# Altium schematic sheet G3-Sensor.SchDoc
size A2; SheetNumber: 3; SheetTotal: 3
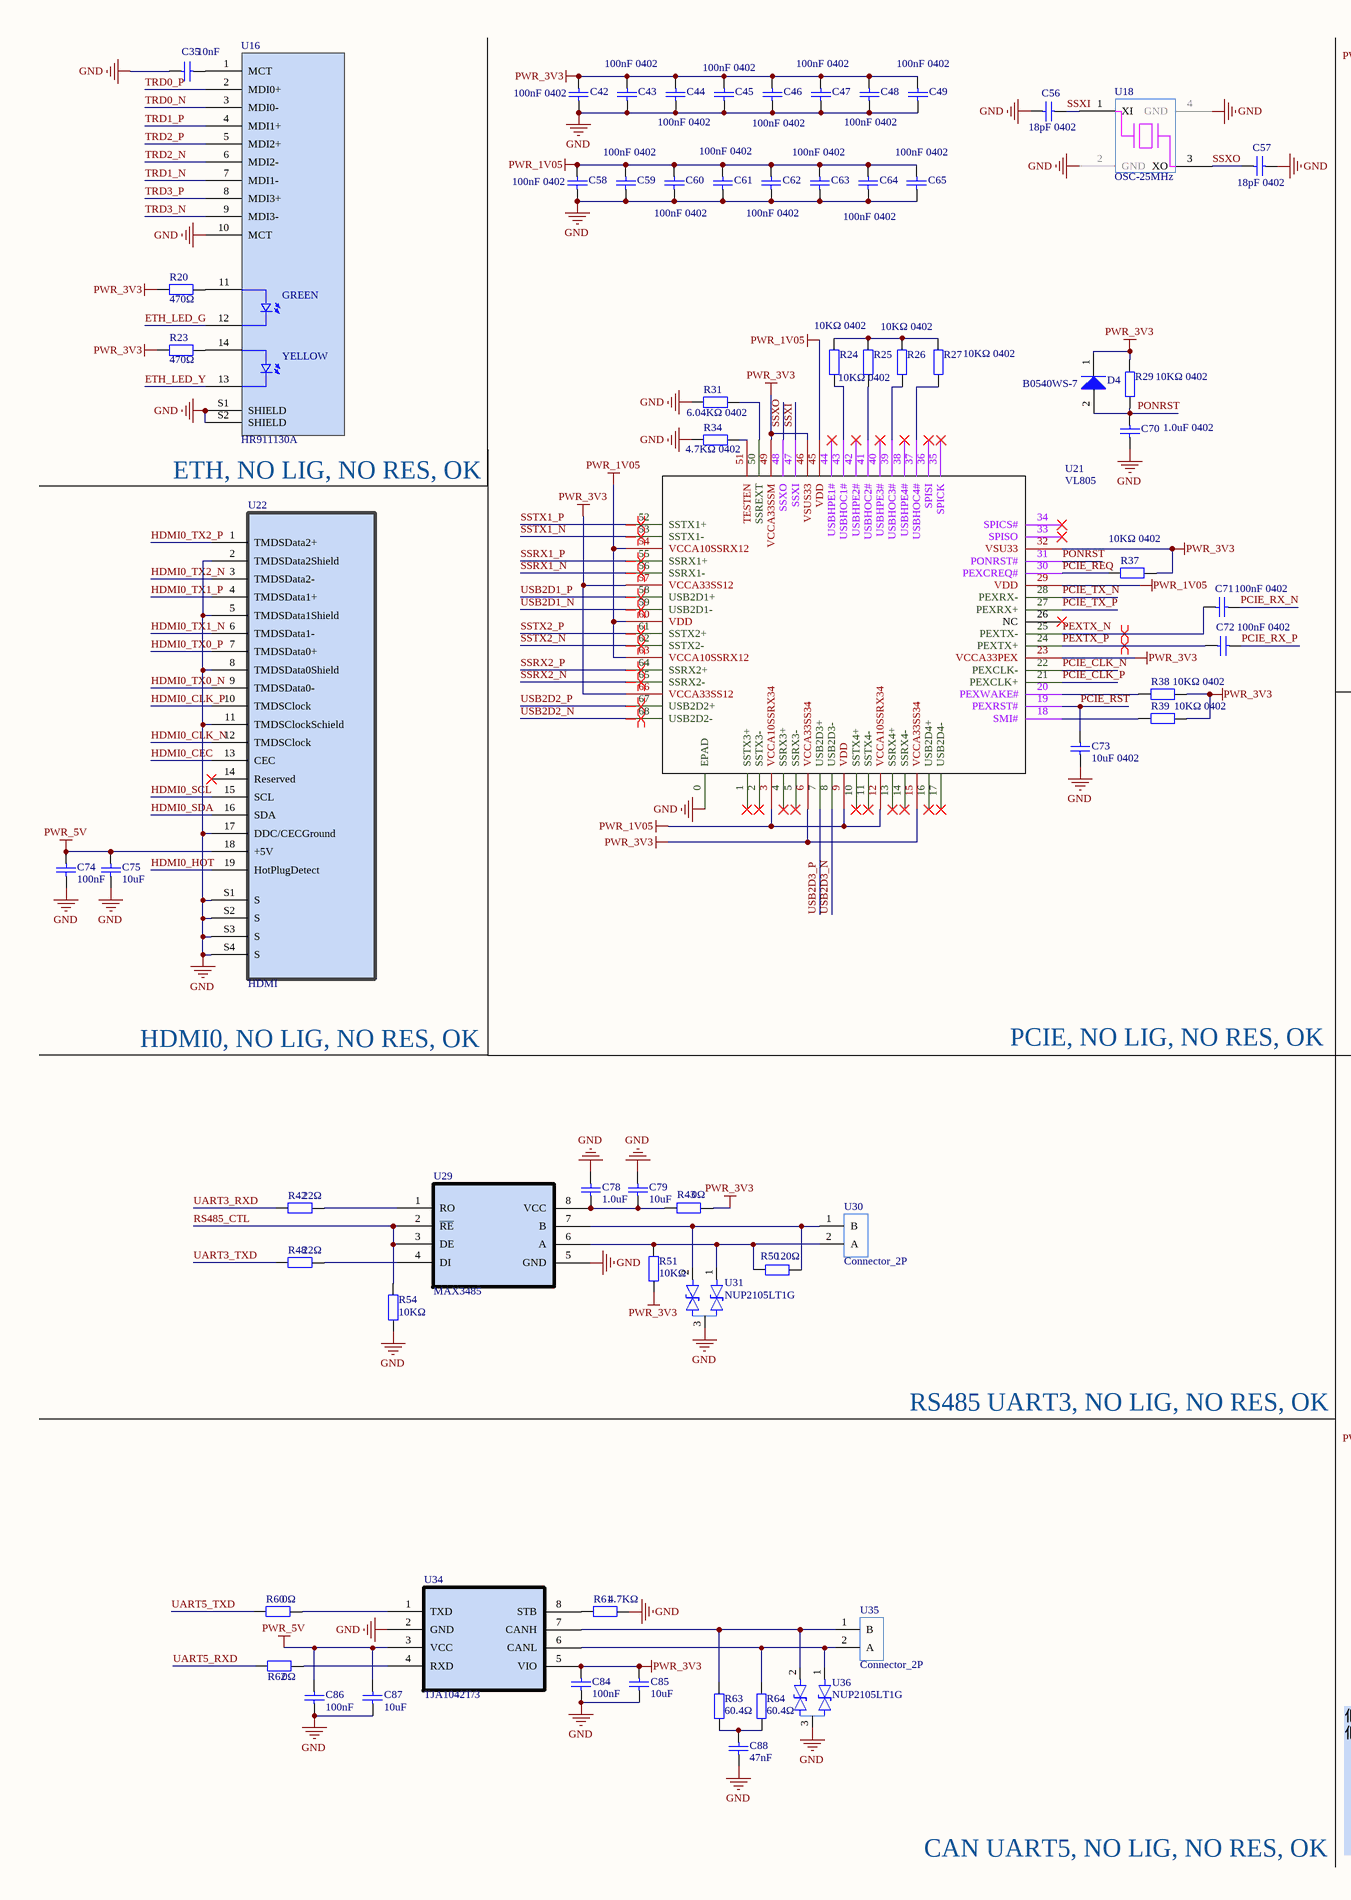
[diagram p0: G3-Sensor.SchDoc, left]
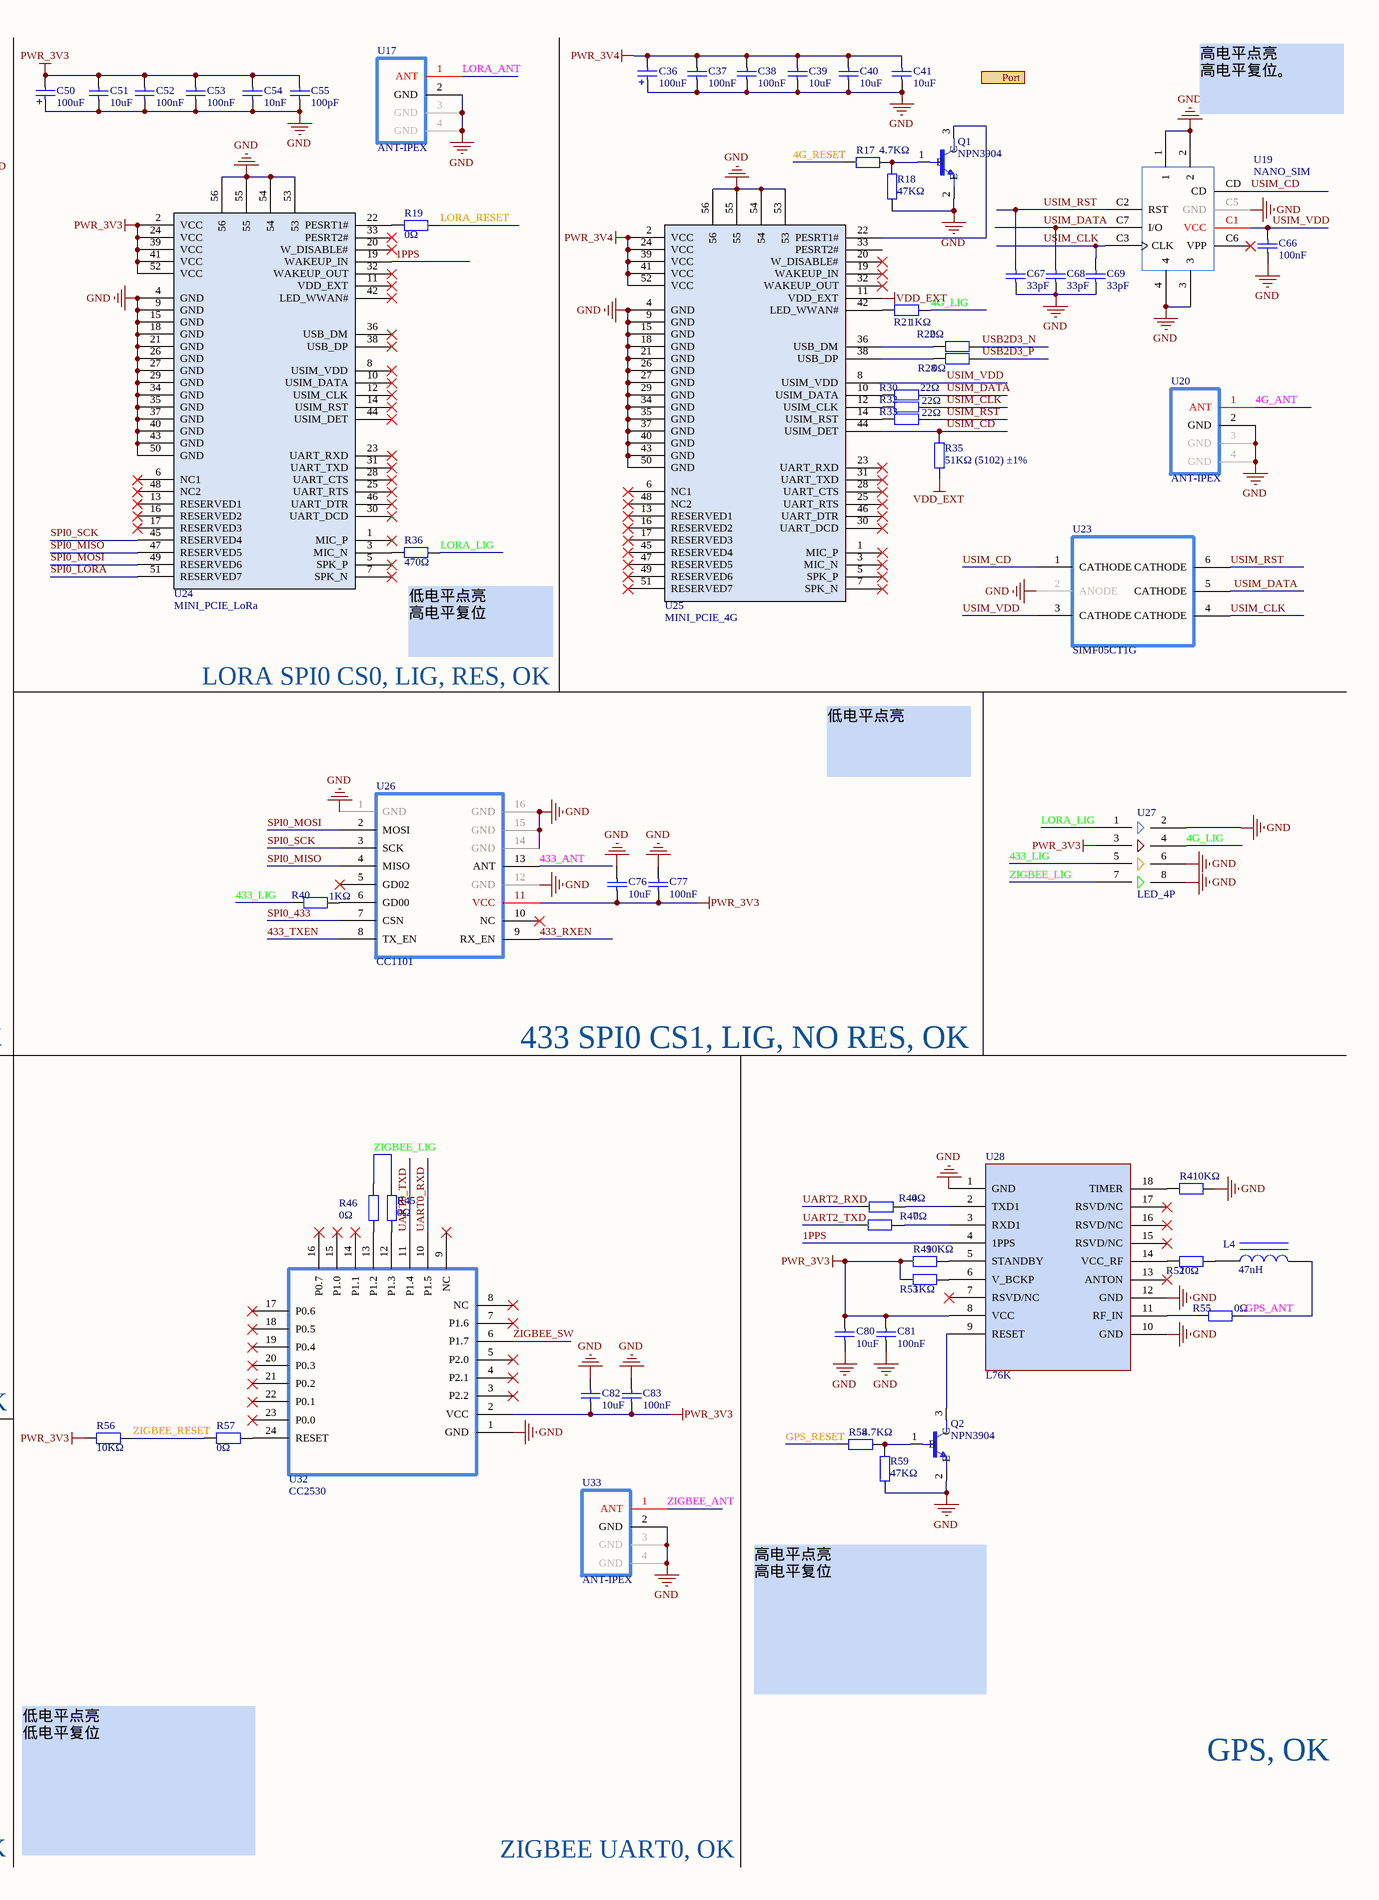
[diagram p1: G3-Sensor.SchDoc, right]

## Parts
C35  10nF  [0402_C]
C36  100uF  [CASE-B_3528]
C37  100nF  [1206_C]
C38  100nF  [1206_C]
C39  10uF  [1206_C]
C40  10uF  [1206_C]
C41  10uF  [1206_C]
C42  100nF 0402  [0402_C]
C43  100nF 0402  [0402_C]
C44  100nF 0402  [0402_C]
C45  100nF 0402  [0402_C]
C46  100nF 0402  [0402_C]
C47  100nF 0402  [0402_C]
C48  100nF 0402  [0402_C]
C49  100nF 0402  [0402_C]
C50  100uF  [CASE-B_3528]
C51  10uF  [0402_C]
C52  100nF  [0402_C]
C53  100nF  [0402_C]
C54  10nF  [0402_C]
C55  100pF  [0402_C]
C56  18pF 0402  [0402_C]
C57  18pF 0402  [0402_C]
C58  100nF 0402  [0402_C]
C59  100nF 0402  [0402_C]
C60  100nF 0402  [0402_C]
C61  100nF 0402  [0402_C]
C62  100nF 0402  [0402_C]
C63  100nF 0402  [0402_C]
C64  100nF 0402  [0402_C]
C65  100nF 0402  [0402_C]
C66  100nF  [0402_C]
C67  33pF  [0402_C]
C68  33pF  [0402_C]
C69  33pF  [0402_C]
C70  1.0uF 0402  [0402_C]
C71  100nF 0402  [0402_C]
C72  100nF 0402  [0402_C]
C73  10uF 0402  [0402_C]
C74  100nF  [0402_C]
C75  10uF  [0402_C]
C76  10uF  [0402_C]
C77  100nF  [0402_C]
C78  1.0uF  [0402_C]
C79  10uF  [0402_C]
C80  10uF  [0402_C]
C81  100nF  [0402_C]
C82  10uF  [0402_C]
C83  100nF  [0402_C]
C84  100nF  [0402_C]
C85  10uF  [0402_C]
C86  100nF  [0402_C]
C87  10uF  [0402_C]
C88  47nF  [0402_C]
D4  B0540WS-7  [B0540WS-7]
L4  47nH  [0603_L]
Q1  NPN3904  [NPN3904]
Q2  NPN3904  [NPN3904]
R17  4.7KΩ  [0402_R]
R18  47KΩ  [0402_R]
R19  0Ω  [0402_R]
R20  470Ω  [0402_R]
R21  1KΩ  [0402_R]
R22  0Ω  [0402_R]
R23  470Ω  [0402_R]
R24  10KΩ 0402  [0402_R]
R25  10KΩ 0402  [0402_R]
R26  10KΩ 0402  [0402_R]
R27  10KΩ 0402  [0402_R]
R28  0Ω  [0402_R]
R29  10KΩ 0402  [0402_R]
R30  22Ω  [0402_R]
R31  6.04KΩ 0402  [0402_R]
R32  22Ω  [0402_R]
R33  22Ω  [0402_R]
R34  4.7KΩ 0402  [0402_R]
R35  51KΩ (5102) ±1%  [0402_R]
R36  470Ω  [0402_R]
R37  10KΩ 0402  [0402_R]
R38  10KΩ 0402  [0402_R]
R39  10KΩ 0402  [0402_R]
R40  1KΩ  [0402_R]
R41  10KΩ  [0402_R]
R42  22Ω  [0402_R]
R43  0Ω  [0402_R]
R44  0Ω  [0402_R]
R45  0Ω  [0402_R]
R46  0Ω  [0402_R]
R47  0Ω  [0402_R]
R48  22Ω  [0402_R]
R49  10KΩ  [0402_R]
R50  120Ω  [0402_R]
R51  10KΩ  [0402_R]
R52  10Ω  [0402_R]
R53  1KΩ  [0402_R]
R54  10KΩ  [0402_R]
R55  0Ω  [0402_R]
R56  10KΩ  [0402_R]
R57  0Ω  [0402_R]
R58  4.7KΩ  [0402_R]
R59  47KΩ  [0402_R]
R60  0Ω  [0402_R]
R61  4.7KΩ  [0402_R]
R62  0Ω  [0402_R]
R63  60.4Ω  [0402_R]
R64  60.4Ω  [0402_R]
U16  HR911130A  [HR911130A]
U17  ANT-IPEX  [ANT-IPEX]
U18  OSC-25MHz  [OSC-25MHz]
U19  NANO_SIM  [NANO_SIM]
U20  ANT-IPEX  [ANT-IPEX]
U21  VL805  [VL805]
U22  HDMI  [HDMI]
U23  SIMF05CT1G  [SMF05CT1G]
U24  MINI_PCIE_LoRa  [MINI-PCIE]
U25  MINI_PCIE_4G  [MINI-PCIE]
U26  CC1101  [CC1101]
U27  LED_4P  [LED_4P]
U28  L76K  [L76K]
U29  MAX3485  [MAX3485]
U30  Connector_2P  [CONNECTOR_2P]
U31  NUP2105LT1G  [NUP2105LT1G]
U32  CC2530  [CC2530]
U33  ANT-IPEX  [ANT-IPEX]
U34  TJA1042T/3  [TJA1042T]
U35  Connector_2P  [CONNECTOR_2P]
U36  NUP2105LT1G  [NUP2105LT1G]

## Ports
Port

## Nets
GND: C35.1 C36.1 C37.1 C38.1 C39.1 C40.1 C41.1 C42.1 C43.1 C44.1 C45.1 C46.1 C47.1 C48.1 C49.1 C50.1 C51.1 C52.1 C53.1 C54.1 C55.1 C56.1 C57.2 C58.1 C59.1 C60.1 C61.1 C62.1 C63.1 C64.1 C65.1 C66.1 C67.1 C68.1 C69.1 C70.2 C73.1 C74.1 C75.1 C76.2 C77.2 C78.2 C79.2 C80.1 C81.1 C82.2 C83.2 C84.1 C85.1 C86.1 C87.1 C88.1 Q1.2(E) Q2.2(E) R18.1 R31.2 R34.2 R41.2 R54.1 R59.1 R61.2 U16.10(MCT) U16.S1(SHIELD) U16.S2(SHIELD) U17.2(GND) U17.3(GND) U17.4(GND) U18.2(GND) U18.4(GND) U19.1 U19.2 U19.3 U19.4 U19.C5(GND) U20.2(GND) U20.3(GND) U20.4(GND) U21.0(EPAD) U22.2(TMDSData2Shield) U22.5(TMDSData1Shield) U22.8(TMDSData0Shield) U22.11(TMDSClockSchield) U22.17(DDC/CECGround) U22.S1(S) U22.S2(S) U22.S3(S) U22.S4(S) U23.2(ANODE) U24.4(GND) U24.9(GND) U24.15(GND) U24.18(GND) U24.21(GND) U24.26(GND) U24.27(GND) U24.29(GND) U24.34(GND) U24.35(GND) U24.37(GND) U24.40(GND) U24.43(GND) U24.50(GND) U24.53 U24.54 U24.55 U24.56 U25.4(GND) U25.9(GND) U25.15(GND) U25.18(GND) U25.21(GND) U25.26(GND) U25.27(GND) U25.29(GND) U25.34(GND) U25.35(GND) U25.37(GND) U25.40(GND) U25.43(GND) U25.50(GND) U25.53 U25.54 U25.55 U25.56 U26.1(GND) U26.12(GND) U26.14(GND) U26.15(GND) U26.16(GND) U27.2 U27.6 U27.8 U28.1(GND) U28.10(GND) U28.12(GND) U29.5(GND) U31.3 U32.1(GND) U33.2(GND) U33.3(GND) U33.4(GND) U34.2(GND) U36.3
PWR_1V05: C58.2 C59.2 C60.2 C61.2 C62.2 C63.2 C64.2 C65.2 U21.3(VCCA10SSRX34) U21.9(VDD) U21.12(VCCA10SSRX34) U21.29(VDD) U21.45(VDD) U21.54(VCCA10SSRX12) U21.60(VDD) U21.63(VCCA10SSRX12)
PWR_3V3: C42.2 C43.2 C44.2 C45.2 C46.2 C47.2 C48.2 C49.2 C50.2 C51.2 C52.2 C53.2 C54.2 C55.2 C76.1 C77.1 C80.2 C81.2 C82.1 C83.1 C84.2 C85.2 D4.1(K) R20.1 R23.1 R29.2 R37.2 R38.2 R39.2 R43.2 R49.1 R51.1 R53.1 R56.1 U21.6(VCCA33SS34) U21.15(VCCA33SS34) U21.23(VCCA33PEX) U21.32(VSU33) U21.46(VSUS33) U21.49(VCCA33SSM) U21.57(VCCA33SS12) U21.66(VCCA33SS12) U24.2(VCC) U24.24(VCC) U24.39(VCC) U24.41(VCC) U24.52(VCC) U26.11(VCC) U27.3 U28.8(VCC) U32.2(VCC) U34.5(VIO)
PWR_3V4: C36.2 C37.2 C38.2 C39.2 C40.2 C41.2 U25.2(VCC) U25.24(VCC) U25.39(VCC) U25.41(VCC) U25.52(VCC)
PWR_5V: C74.2 C75.2 C86.2 C87.2 U22.18(+5V) U34.3(VCC)
VDD_EXT: R35.1 U25.11(VDD_EXT)
1PPS: U24.19(WAKEUP_IN) U28.4(1PPS)
4G_ANT: U20.1(ANT)
4G_LIG: R21.2 U27.4
4G_RESET: R17.1
433_ANT: U26.13(ANT)
433_LIG: R40.1 U27.5
433_RXEN: U26.9(RX_EN)
433_TXEN: U26.8(TX_EN)
ETH_LED_G: U16.12
ETH_LED_Y: U16.13
GPS_ANT: L4.2 R55.2
GPS_RESET: R58.1
HDMI0_CEC: U22.13(CEC)
HDMI0_CLK_N: U22.12(TMDSClock)
HDMI0_CLK_P: U22.10(TMDSClock)
HDMI0_HOT: U22.19(HotPlugDetect)
HDMI0_SCL: U22.15(SCL)
HDMI0_SDA: U22.16(SDA)
HDMI0_TX0_N: U22.9(TMDSData0-)
HDMI0_TX0_P: U22.7(TMDSData0+)
HDMI0_TX1_N: U22.6(TMDSData1-)
HDMI0_TX1_P: U22.4(TMDSData1+)
HDMI0_TX2_N: U22.3(TMDSData2-)
HDMI0_TX2_P: U22.1(TMDSData2+)
LORA_ANT: U17.1(ANT)
LORA_LIG: R36.2 U27.1
LORA_RESET: R19.1
PCIE_CLK_N: U21.22(PEXCLK-)
PCIE_CLK_P: U21.21(PEXCLK+)
PCIE_REQ: R37.1 U21.30(PEXCREQ#)
PCIE_RST: C73.2 U21.19(PEXRST#)
PCIE_RX_N: C71.2
PCIE_RX_P: C72.2
PCIE_TX_N: U21.28(PEXRX-)
PCIE_TX_P: U21.27(PEXRX+)
PEXTX_N: C71.1 U21.25(PEXTX-)
PEXTX_P: C72.1 U21.24(PEXTX+)
PONRST: C70.1 D4.2(A) R29.1 U21.31(PONRST#)
RS485_CTL: R54.2 U29.2(~{RE}) U29.3(DE)
SPI0_433: U26.7(CSN)
SPI0_LORA: U24.51(RESERVED7)
SPI0_MISO: U24.47(RESERVED5) U26.4(MISO)
SPI0_MOSI: U24.49(RESERVED6) U26.2(MOSI)
SPI0_SCK: U24.45(RESERVED4) U26.3(SCK)
SSRX1_N: U21.56(SSRX1-)
SSRX1_P: U21.55(SSRX1+)
SSRX2_N: U21.65(SSRX2-)
SSRX2_P: U21.64(SSRX2+)
SSTX1_N: U21.53(SSTX1-)
SSTX1_P: U21.52(SSTX1+)
SSTX2_N: U21.62(SSTX2-)
SSTX2_P: U21.61(SSTX2+)
SSXI: C56.2 U18.1(XI) U21.47(SSXI)
SSXO: C57.1 U18.3(XO) U21.48(SSXO)
TRD0_N: U16.3(MDI0-)
TRD0_P: U16.2(MDI0+)
TRD1_N: U16.7(MDI1-)
TRD1_P: U16.4(MDI1+)
TRD2_N: U16.6(MDI2-)
TRD2_P: U16.5(MDI2+)
TRD3_N: U16.9(MDI3-)
TRD3_P: U16.8(MDI3+)
UART0_RXD: U32.10(P1.5)
UART0_TXD: U32.11(P1.4)
UART2_RXD: R44.1
UART2_TXD: R47.1
UART3_RXD: R42.1
UART3_TXD: R48.1
UART5_RXD: R62.1
UART5_TXD: R60.1
USB2D1_N: U21.59(USB2D1-)
USB2D1_P: U21.58(USB2D1+)
USB2D2_N: U21.68(USB2D2-)
USB2D2_P: U21.67(USB2D2+)
USB2D3_N: R22.1 U21.8(USB2D3-)
USB2D3_P: R28.2 U21.7(USB2D3+)
USIM_CD: R35.2 U19.CD U23.1(CATHODE) U25.44(USIM_DET)
USIM_CLK: C69.2 R32.2 U19.C3(CLK) U23.4(CATHODE)
USIM_DATA: C68.2 R30.2 U19.C7(I/O) U23.5(CATHODE)
USIM_RST: C67.2 R33.2 U19.C2(RST) U23.6(CATHODE)
USIM_VDD: C66.2 U19.C1(VCC) U23.3(CATHODE) U25.8(USIM_VDD)
ZIGBEE_ANT: U33.1(ANT)
ZIGBEE_LIG: R45.2 R46.2 U27.7
ZIGBEE_RESET: R56.2 R57.2
ZIGBEE_SW: U32.6(P1.7)
NetC35_2: C35.2 U16.1(MCT)
NetC78_1: C78.1 C79.1 R43.1 U29.8(VCC)
NetC88_2: C88.2 R63.1 R64.1
NetL4_1: L4.1 R52.2
NetQ1_1: Q1.1(B) R17.2 R18.2
NetQ1_3: Q1.3(C) U25.22(PESRT1#)
NetQ2_1: Q2.1(B) R58.2 R59.2
NetQ2_3: Q2.3(C) U28.9(RESET)
NetR19_2: R19.2 U24.22(PESRT1#)
NetR20_2: R20.2 U16.11
NetR21_1: R21.1 U25.42(LED_WWAN#)
NetR22_2: R22.2 U25.36(USB_DM)
NetR23_2: R23.2 U16.14
NetR24_1: R24.1 U21.43(USBHOC1#)
NetR24_2: R24.2 R25.2 R26.2 R27.2
NetR25_1: R25.1 U21.41(USBHOC2#)
NetR26_1: R26.1 U21.39(USBHOC3#)
NetR27_1: R27.1 U21.37(USBHOC4#)
NetR28_1: R28.1 U25.38(USB_DP)
NetR30_1: R30.1 U25.10(USIM_DATA)
NetR31_1: R31.1 U21.50(SSREXT)
NetR32_1: R32.1 U25.12(USIM_CLK)
NetR33_1: R33.1 U25.14(USIM_RST)
NetR34_1: R34.1 U21.51(TESTEN)
NetR36_1: R36.1 U24.3(MIC_N)
NetR38_1: R38.1 U21.20(PEXWAKE#)
NetR39_1: R39.1 U21.18(SMI#)
NetR40_2: R40.2 U26.6(GD00)
NetR41_1: R41.1 U28.18(TIMER)
NetR42_2: R42.2 U29.1(RO)
NetR44_2: R44.2 U28.2(TXD1)
NetR45_1: R45.1 U32.12(P1.3)
NetR46_1: R46.1 U32.13(P1.2)
NetR47_2: R47.2 U28.3(RXD1)
NetR48_2: R48.2 U29.4(DI)
NetR49_2: R49.2 U28.5(STANDBY)
NetR50_1: R50.1 U29.7(B) U30.1(B) U31.2
NetR50_2: R50.2 R51.2 U29.6(A) U30.2(A) U31.1
NetR52_1: R52.1 U28.14(VCC_RF)
NetR53_2: R53.2 U28.6(V_BCKP)
NetR55_1: R55.1 U28.11(RF_IN)
NetR57_1: R57.1 U32.24(RESET)
NetR60_2: R60.2 U34.1(TXD)
NetR61_1: R61.1 U34.8(STB)
NetR62_2: R62.2 U34.4(RXD)
NetR63_2: R63.2 U34.7(CANH) U35.1(B) U36.2
NetR64_2: R64.2 U34.6(CANL) U35.2(A) U36.1

Not connected (* = marked no-connect by the designer): U19 C6(VPP)*; U21 1(SSTX3+)* 2(SSTX3-)* 4(SSRX3+)* 5(SSRX3-)* 10(SSTX4+)* 11(SSTX4-)* 13(SSRX4+)* 14(SSRX4-)* 16(USB2D4+)* 17(USB2D4-)* 26(NC)* 33(SPISO)* 34(SPICS#)* 35(SPICK)* 36(SPISI)* 38(USBHPE4#)* 40(USBHPE3#)* 42(USBHPE2#)* 44(USBHPE1#)*; U22 14(Reserved)*; U24 1(MIC_P)* 5(SPK_P)* 6(NC1)* 7(SPK_N)* 8(USIM_VDD)* 10(USIM_DATA)* 11(VDD_EXT)* 12(USIM_CLK)* 13(RESERVED1)* 14(USIM_RST)* 16(RESERVED2)* 17(RESERVED3)* 20(W_DISABLE#)* 23(UART_RXD)* 25(UART_RTS)* 28(UART_CTS)* 30(UART_DCD)* 31(UART_TXD)* 32(WAKEUP_OUT)* 33(PESRT2#)* 36(USB_DM)* 38(USB_DP)* 42(LED_WWAN#)* 44(USIM_DET)* 46(UART_DTR)* 48(NC2)*; U25 1(MIC_P)* 3(MIC_N)* 5(SPK_P)* 6(NC1)* 7(SPK_N)* 13(RESERVED1)* 16(RESERVED2)* 17(RESERVED3)* 19(WAKEUP_IN)* 20(W_DISABLE#)* 23(UART_RXD)* 25(UART_RTS)* 28(UART_CTS)* 30(UART_DCD)* 31(UART_TXD)* 32(WAKEUP_OUT)* 33(PESRT2#) 45(RESERVED4)* 46(UART_DTR)* 47(RESERVED5)* 48(NC2)* 49(RESERVED6)* 51(RESERVED7)*; U26 5(GD02)* 10(NC)*; U28 7(RSVD/NC)* 13(ANTON)* 15(RSVD/NC)* 16(RSVD/NC)* 17(RSVD/NC)*; U32 3(P2.2)* 4(P2.1)* 5(P2.0)* 7(P1.6)* 8(NC)* 9(NC)* 14(P1.1)* 15(P1.0)* 16(P0.7)* 17(P0.6)* 18(P0.5)* 19(P0.4)* 20(P0.3)* 21(P0.2)* 22(P0.1)* 23(P0.0)*

## Layout directives
differential pair: PEXTX_N, PEXTX_P, SSRX1_N, SSRX1_P, SSRX2_N, SSRX2_P, SSTX1_N, SSTX1_P, SSTX2_N, SSTX2_P, USB2D1_N, USB2D1_P, USB2D2_N, USB2D2_P

## Notes on the sheet
- 高电平点亮
  高电平复位。
- (near U16) ETH, NO LIG, NO RES, OK
- 低电平点亮
  高电平复位
- LORA SPI0 CS0, LIG, RES, OK
- 低电平点亮
- HDMI0, NO LIG, NO RES, OK
- PCIE, NO LIG, NO RES, OK
- 433 SPI0 CS1, LIG, NO RES, OK
- RS485 UART3, NO LIG, NO RES, OK
- 高电平点亮
  高电平复位
- GPS, OK
- CAN UART5, NO LIG, NO RES, OK
- 低电平点亮
  低电平复位
- ZIGBEE UART0, OK
- (in symbol HR911130A) GREEN; YELLOW

## Library data of the parts
C35 C54 = 0402 10nF (103) 10% 50V: 贴片电容; ComponentLink1Description: 供应商链接; ComponentLink1URL: http://www.szlcsc.com/product/details_15869.html; Package: 0402; Supplier: LC; SuppliersPartNumber: C15195
C36 C50 = 3528 100uF (107) 10% 6.3V: 钽电容; ComponentLink1Description: 供应商链接; ComponentLink1URL: http://www.szlcsc.com/product/details_16815.html; Package: 3528; Supplier: LC; SuppliersPartNumber: C16133
C37 C38 = 1206 100nF (104) 10% 50V: 贴片电容; ComponentLink1Description: 供应商链接; ComponentLink1URL: http://www.szlcsc.com/product/details_25237.html; Package: 1206; Supplier: LC; SuppliersPartNumber: C24497
C39-C41 = 1206 10uF (106) 10% 50V: 贴片电容; ComponentLink1Description: 供应商链接; ComponentLink1URL: http://www.szlcsc.com/product/details_14236.html; Package: 1206; Supplier: LC; SuppliersPartNumber: C13585
C42-C49 C52 C53 C58-C66 C71 C72 C74 C77 C81 C83 C84 C86 C88 = 0402 100nF (104) 10% 16V: 贴片电容; ComponentLink1Description: 供应商链接; ComponentLink1URL: http://www.szlcsc.com/product/details_1877.html; Package: 0402; Supplier: LC; SuppliersPartNumber: C1525
C51 C73 C75 C76 C79 C80 C82 C85 C87 = 0402 10uF (106) 20% 6.3V: 贴片电容; ComponentLink1Description: 供应商链接; ComponentLink1URL: http://www.szlcsc.com/product/details_16204.html; Package: 0402; Supplier: LC; SuppliersPartNumber: C15525
C55 = 0402 100pF (101) 5% 50V: 贴片电容; ComponentLink1Description: 供应商链接; ComponentLink1URL: http://www.szlcsc.com/product/details_1898.html; Package: 0402; Supplier: LC; SuppliersPartNumber: C1546
C56 C57 = 0402 18pF (180) 5% 50V: 贴片电容; ComponentLink1Description: 供应商链接; ComponentLink1URL: http://www.szlcsc.com/product/details_1901.html; Package: 0402; Supplier: LC; SuppliersPartNumber: C1549
C67-C69 = 0402 33pF (330) 5% 50V: 贴片电容; ComponentLink1Description: 供应商链接; ComponentLink1URL: http://www.szlcsc.com/product/details_1914.html; Package: 0402; Supplier: LC; SuppliersPartNumber: C1562
C70 C78 = 0402 1.0uF (105) 10% 25V: 贴片电容; ComponentLink1Description: 供应商链接; ComponentLink1URL: http://www.szlcsc.com/product/details_53938.html; Package: 0402; Supplier: LC; SuppliersPartNumber: C52923
L4 = 0603 47nH: 贴片电感; ComponentLink1Description: 供应商链接; ComponentLink1URL: http://www.szlcsc.com/product/details_30437.html; Package: 0603; Supplier: LC; SuppliersPartNumber: C29683
Q1 Q2 = NPN3904: Bipolar _BJT_ Transistor NPN 40V 200mA 300MHz 300mW Surface Mount SOT-23-3 _TO-236_; MF: ON Semiconductor; MP: MMBT3904LT1G; Value: *; Package: SOT-23-3 NXP Semiconductors; SnapEDA_Link: https://www.snapeda.com/parts/MMBT3904LT1G/ON%20Semiconductor/view-part/587490/?ref=snap; Price: None; Availability: Unavailable
R17 R34 R58 R61 = 0402 4.7KΩ (4701) 1%: 贴片电阻; ComponentLink1Description: 供应商链接; ComponentLink1URL: http://www.szlcsc.com/product/details_26643.html; Package: 0402; Supplier: LC; SuppliersPartNumber: C25900
R18 R59 = 0402 47KΩ (4702) 1%: 贴片电阻; ComponentLink1Description: 供应商链接; ComponentLink1URL: http://www.szlcsc.com/product/details_26535.html; Package: 0402; Supplier: LC; SuppliersPartNumber: C25792
R19 R22 R28 R43-R47 R55 R57 R60 R62 = 0402 0Ω (0R0) 1%: 贴片电阻; ComponentLink1Description: 供应商链接; ComponentLink1URL: http://www.szlcsc.com/product/details_17853.html; Package: 0402; Supplier: LC; SuppliersPartNumber: C17168
R20 R23 R36 = 0402 470Ω (4700) 1%: 贴片电阻; ComponentLink1Description: 供应商链接; ComponentLink1URL: http://www.szlcsc.com/product/details_25860.html; Package: 0402; Supplier: LC; SuppliersPartNumber: C25117
R21 R40 R53 = 0402 1KΩ (1001) 1%: 贴片电阻; ComponentLink1Description: 供应商链接; ComponentLink1URL: http://www.szlcsc.com/product/details_12256.html; Package: 0402; Supplier: LC; SuppliersPartNumber: C11702
R24-R27 R29 R37-R39 R41 R49 R51 R54 R56 = 0402 10KΩ (1002) 1%: 贴片电阻; ComponentLink1Description: 供应商链接; ComponentLink1URL: http://www.szlcsc.com/product/details_26487.html; Package: 0402; Supplier: LC; SuppliersPartNumber: C25744
R30 R32 R33 R42 R48 R63 R64 = 0402 22Ω (22R0) 1%: 贴片电阻; ComponentLink1Description: 供应商链接; ComponentLink1URL: http://www.szlcsc.com/product/details_25835.html; Package: 0402; Supplier: LC; SuppliersPartNumber: C25092
R31 = 0402 5.6KΩ (5601) 1%: 贴片电阻; ComponentLink1Description: 供应商链接; ComponentLink1URL: http://www.szlcsc.com/product/details_26651.html; Package: 0402; Supplier: LC; SuppliersPartNumber: C25908
R35 = 0402 51KΩ (5102) 1%: 贴片电阻; ComponentLink1Description: 供应商链接; ComponentLink1URL: http://www.szlcsc.com/product/details_26537.html; Package: 0402; Supplier: LC; SuppliersPartNumber: C25794
R50 = 0402 120Ω (1200) 1%: 贴片电阻; ComponentLink1Description: 供应商链接; ComponentLink1URL: http://www.szlcsc.com/product/details_25822.html; Package: 0402; Supplier: LC; SuppliersPartNumber: C25079
R52 = 0402 10Ω (10R0) 1%: 贴片电阻; ComponentLink1Description: 供应商链接; ComponentLink1URL: http://www.szlcsc.com/product/details_25820.html; Package: 0402; Supplier: LC; SuppliersPartNumber: C25077
U16 = HR911130A: RJ45
U17 U20 U33 = ANT-IPEX: ANT
U18 = OSC-25MHz: Passive crystal oscillator
U19 = NANO_SIM: 4G Card Slot
U21 = VL805: PCIe to USB3.0
U24 U25 = MINI_PCIE: LoRa, 4G
U26 = CC1101: 433Mhz
U27 = LED_4P: LED
U28 = L76K: GPS BEIDOU
U29 = MAX3485: UART = RS485
U30 U35 = Connector_2P: Connector for RS485, CAN
U32 = CC2530: ZigBee 2.4GHz
U34 = TJA1042T/3: UART = CAN